# Altium schematic sheet Smart Stepper Fin - Driver - DRV8825.SchDoc
size A
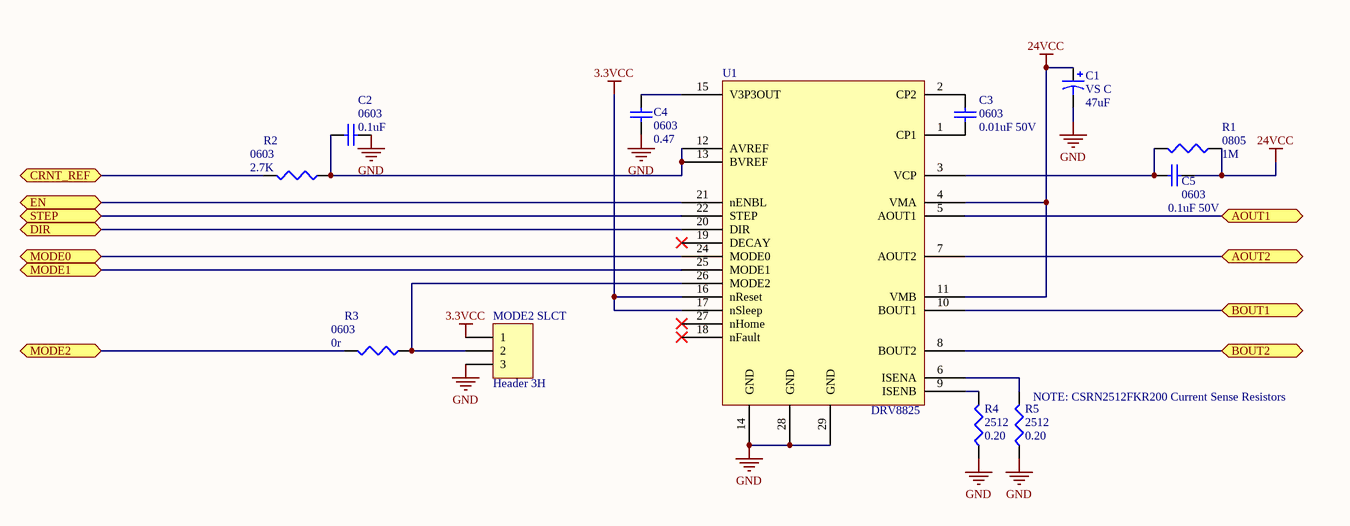
[diagram p0: Smart Stepper Fin - Driver - DRV8825.SchDoc]

## Parts
C1  VS C  value 47uF  [Panasonic VS C]
C2  0603  value 0.1uF  [1608[0603]]
C3  0603  value 0.01uF 50V  [1608[0603]]
C4  0603  value 0.47  [1608[0603]]
C5  0603  value 0.1uF 50V  [1608[0603]]
MODE2_SLCT  Header 3H  [HDR1X3H]
R1  0805  value 1M  [J1-0603]
R2  0603  value 2.7K  [J1-0603]
R3  0603  value 0r  [J1-0603]
R4  2512  value 0.20  [Resistor2512]
R5  2512  value 0.20  [Resistor2512]
U1  DRV8825  [DRV8825]

## Ports
AOUT1, AOUT2, BOUT1, BOUT2, CRNT_REF, DIR, EN, MODE0, MODE1, MODE2, STEP

## Nets
3.3VCC: MODE2_SLCT.1 U1.16(nReset) U1.17(nSleep)
24VCC: C1.1 C5.1 R1.1 U1.4(VMA) U1.11(VMB)
GND: C1.2 C2.1 C4.1 MODE2_SLCT.3 R4.1 R5.1 U1.14(GND) U1.28(GND) U1.29(GND)
AOUT1: U1.5(AOUT1) ; port AOUT1
AOUT2: U1.7(AOUT2) ; port AOUT2
BOUT1: U1.10(BOUT1) ; port BOUT1
BOUT2: U1.8(BOUT2) ; port BOUT2
CRNT_REF: R2.2 ; port CRNT_REF
DIR: U1.20(DIR) ; port DIR
EN: U1.21(nENBL) ; port EN
MODE0: U1.24(MODE0) ; port MODE0
MODE1: U1.25(MODE1) ; port MODE1
MODE2: R3.2 ; port MODE2
STEP: U1.22(STEP) ; port STEP
NetC2_2: C2.2 R2.1 U1.12(AVREF) U1.13(BVREF)
NetC3_1: C3.1 U1.1(CP1)
NetC3_2: C3.2 U1.2(CP2)
NetC4_2: C4.2 U1.15(V3P3OUT)
NetC5_2: C5.2 R1.2 U1.3(VCP)
NetMODE2_SLCT_2: MODE2_SLCT.2 R3.1 U1.26(MODE2)
NetR4_2: R4.2 U1.9(ISENB)
NetR5_2: R5.2 U1.6(ISENA)

Not connected (* = marked no-connect by the designer): U1 18(nFault)* 19(DECAY)* 23(NC) 27(nHome)*

## Notes on the sheet
- (near R5) NOTE: CSRN2512FKR200 Current Sense Resistors

## Library data of the parts
C1 = Cap Pol1: Polarized Capacitor (Radial); Published: 8-Jun-2000; LatestRevisionDate: 17-Jul-2002; LatestRevisionNote: Re-released for DXP Platform.; PackageReference: RB7.6-15; Publisher: Altium Limited; PackageDescription: Polarized Capacitor (Radial); 2 Leads
C2-C5 = Cap Semi: Capacitor (Semiconductor SIM Model); Published: 8-Jun-2000; LatestRevisionDate: 29-May-2009; LatestRevisionNote: IPC-7351 Footprint Added.; PackageReference: C1206; Publisher: Altium Limited; PackageDescription: Chip Capacitor
MODE2_SLCT = Header 3H: Header, 3-Pin, Right Angle; LatestRevisionDate: 17-Jul-2002; LatestRevisionNote: Re-released for DXP Platform.; Publisher: Altium Limited
R1-R5 = Res3: Resistor; Published: 8-Jun-2000; LatestRevisionDate: 29-May-2009; LatestRevisionNote: IPC-7351 Footprint Added.; PackageReference: J1-0603; Publisher: Altium Limited; PackageDescription: Chip Resistor
U1 = DRV8825: DRV8825 Ti Stepper Driver